# EAGLE design float002 (EAGLE 6.4)
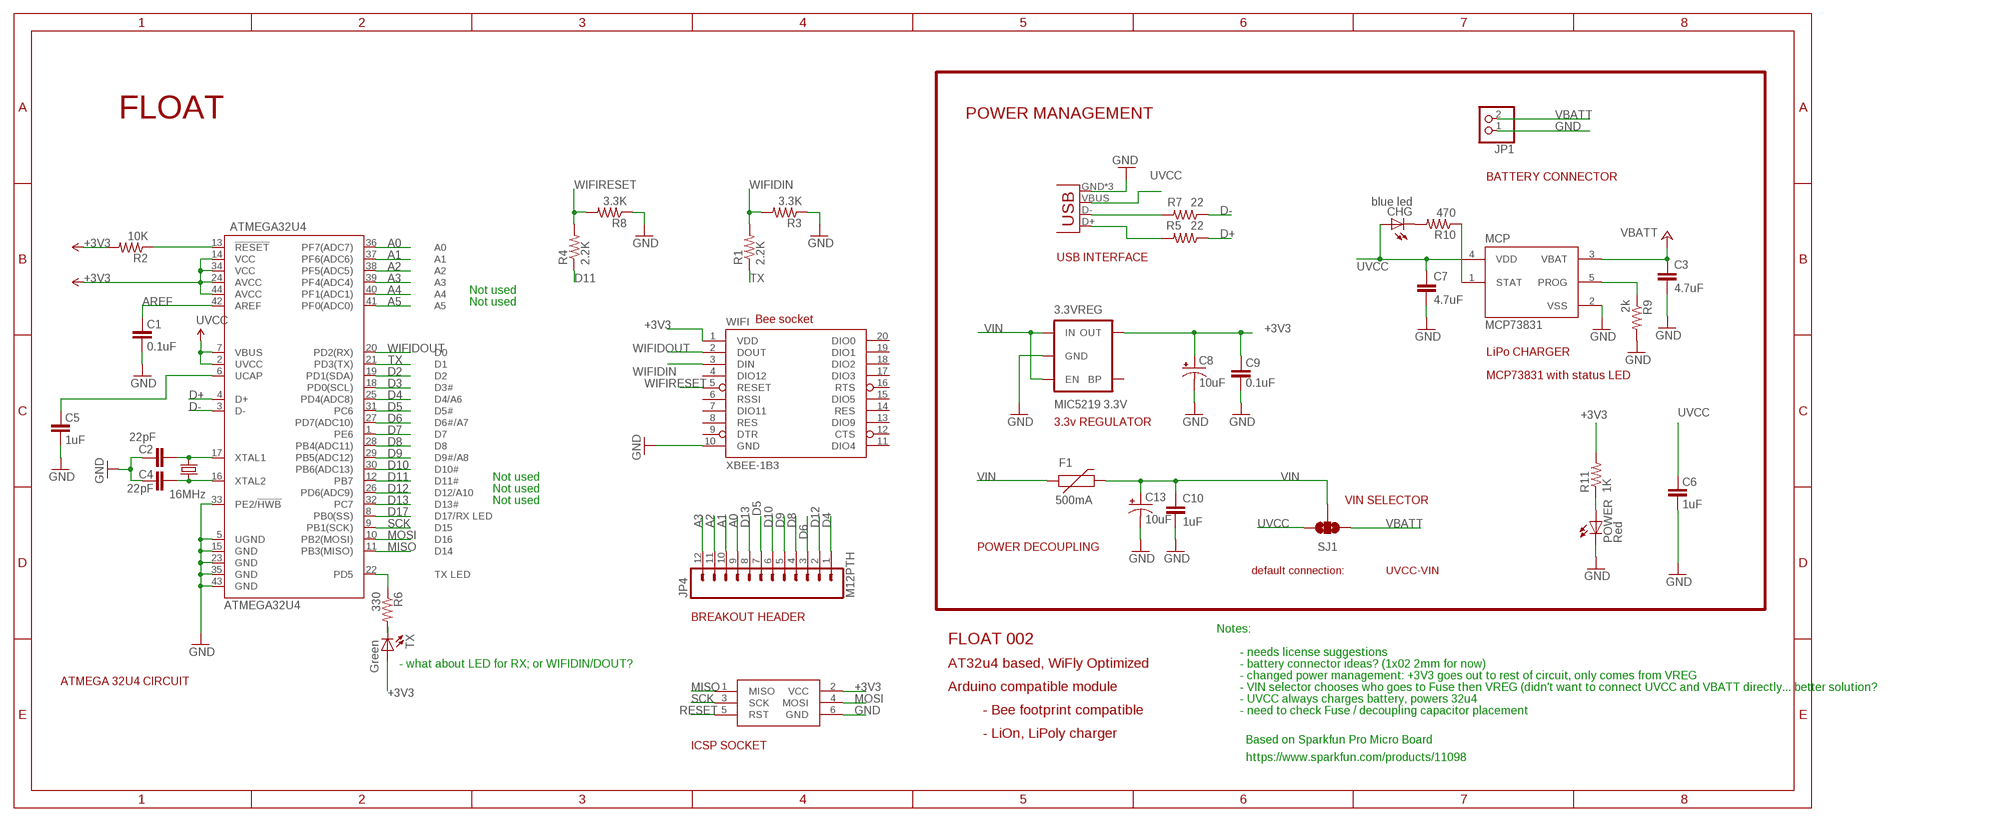
[diagram p0: schematic, sheet 1]

## Parts
3.3VREG  MIC5219 3.3V  V_REG_MIC52193.3V  [SOT23-5]
ATMEGA32U4  ATMEGA32U4  ATMEGA32U4TQFP  [SPARKFUN-DIGITALIC_TQFP44]
C1  0.1uF  CAP0402-CAP  [0402-CAP]
C2  22pF  CAP0402-CAP  [0402-CAP]
C3  4.7uF  .1UF-CER  [0402-CAP]
C4  22pF  CAP0402-CAP  [0402-CAP]
C5  1uF  CAP0402-CAP  [0402-CAP]
C6  1uF  CAP0402-CAP  [0402-CAP]
C7  4.7uF  .1UF-CER  [0402-CAP]
C8  10uF  CAP_POL1206  [EIA3216]
C9  0.1uF  CAP0402-CAP  [0402-CAP]
C10  1uF  CAP0402-CAP  [0402-CAP]
C13  10uF  CAP_POL1206  [EIA3216]
CHG  blue led  LEDCHIP-LED0805  [CHIP-LED0805]
F1  500mA  PTCSMD  [PTC-1206]
ISP1  AVRISP-6  [AVRISP]
JP1  PINHD-1X2  [1X02]
JP4  M12PTH  [1X12]
MCP  MCP73831  [SOT23-5]
POWER  Red  LED0603  [LED-0603]
R1  2.2K  RESISTOR0402-RES  [0402-RES]
R2  10K  RESISTOR0402-RES  [0402-RES]
R3  3.3K  RESISTOR0402-RES  [0402-RES]
R4  2.2K  RESISTOR0402-RES  [0402-RES]
R5  22  RESISTOR0402-RES  [0402-RES]
R6  330  RESISTOR0402-RES  [0402-RES]
R7  22  RESISTOR0402-RES  [0402-RES]
R8  3.3K  RESISTOR0402-RES  [0402-RES]
R9  2k  RESISTOR0402-RES  [0402-RES]
R10  470  RESISTOR0402-RES  [0402-RES]
R11  1K  RESISTOR0402-RES  [0402-RES]
SJ1  SOLDERJUMPER_2WAYPASTE1&2  [SJ_3_PASTE1&2]
TX  Green  LED0603  [LED-0603]
WIFI  XBEE-1B3  [XBEE-SMD]
X2  USB-MICROB  [USB-MICROB]
Y1  16MHz  CRYSTAL5X3  [CRYSTAL-SMD-5X3]

## Nets
+3V3: 3.3VREG.5(OUT) ATMEGA32U4.14(VCC) ATMEGA32U4.24(AVCC) ATMEGA32U4.34(VCC) ATMEGA32U4.44(AVCC) C8.A(+) C9.2 ISP1.2(VCC) R2.2 R11.2 TX.A WIFI.1(VDD) ; supply symbol labelled VCC
A0: ATMEGA32U4.36(PF7(ADC7)) JP4.9
A1: ATMEGA32U4.37(PF6(ADC6)) JP4.10
A2: ATMEGA32U4.38(PF5(ADC5)) JP4.11
A3: ATMEGA32U4.39(PF4(ADC4)) JP4.12
A4: ATMEGA32U4.40(PF1(ADC1))
A5: ATMEGA32U4.41(PF0(ADC0))
AREF: ATMEGA32U4.42(AREF) C1.2
D2: ATMEGA32U4.19(PD1(SDA))
D3: ATMEGA32U4.18(PD0(SCL))
D4: ATMEGA32U4.25(PD4(ADC8)) JP4.1
D5: ATMEGA32U4.31(PC6) JP4.7
D6: ATMEGA32U4.27(PD7(ADC10)) JP4.3
D7: ATMEGA32U4.1(PE6)
D8: ATMEGA32U4.28(PB4(ADC11)) JP4.4
D9: ATMEGA32U4.29(PB5(ADC12)) JP4.5
D10: ATMEGA32U4.30(PB6(ADC13)) JP4.6
D11: ATMEGA32U4.12(PB7) R4.1
D12: ATMEGA32U4.26(PD6(ADC9)) JP4.2
D13: ATMEGA32U4.32(PC7) JP4.8
D17: ATMEGA32U4.8(PB0(SS))
D+: ATMEGA32U4.4(D+) R5.1
D-: ATMEGA32U4.3(D-) R7.1
GND [vcc]: 3.3VREG.2(GND) ATMEGA32U4.5(UGND) ATMEGA32U4.15(GND) ATMEGA32U4.23(GND) ATMEGA32U4.33(PE2/!HWB) ATMEGA32U4.35(GND) ATMEGA32U4.43(GND) C1.1 C2.2 C3.2 C4.2 C5.1 C6.1 C7.2 C8.C(-) C9.1 C10.2 C13.C(-) ISP1.6(GND) JP1.1 MCP.2(VSS) POWER.C R3.1 R8.1 R9.2 WIFI.10(GND) X2.GND X2.MT1(GND) X2.MT2(GND)
MISO: ATMEGA32U4.11(PB3(MISO)) ISP1.1(MISO)
MOSI: ATMEGA32U4.10(PB2(MOSI)) ISP1.4(MOSI)
N$1: ATMEGA32U4.16(XTAL2) C4.1 Y1.1
N$2: ATMEGA32U4.17(XTAL1) C2.1 Y1.3
N$4: ATMEGA32U4.6(UCAP) C5.2
N$6: R7.2 X2.D-
N$7: R6.2 TX.C
N$8: R5.2 X2.D+
N$9: MCP.5(PROG) R9.1
N$22: MCP.1(STAT) R10.1
N$23: CHG.C R10.2
N$38: POWER.A R11.1
RESET: ATMEGA32U4.13(!RESET) ISP1.5(RST) R2.1
SCK: ATMEGA32U4.9(PB1(SCK)) ISP1.3(SCK)
TX: ATMEGA32U4.21(PD3(TX)) R1.1
TXLED: ATMEGA32U4.22(PD5) R6.1
UVCC: ATMEGA32U4.2(UVCC) ATMEGA32U4.7(VBUS) C6.2 C7.1 CHG.A MCP.4(VDD) SJ1.3 X2.VBUS
VBATT: C3.1 JP1.2 MCP.3(VBAT) SJ1.1
VIN: 3.3VREG.1(IN) 3.3VREG.3(EN) C10.1 C13.A(+) F1.1 F1.2 SJ1.2
WIFIDIN: R1.2 R3.2 WIFI.3(DIN)
WIFIDOUT: ATMEGA32U4.20(PD2(RX)) WIFI.2(DOUT)
WIFIRESET: R4.2 R8.2 WIFI.5(RESET)
Unconnected: 3.3VREG.4(BP) WIFI.4(DIO12) WIFI.6(RSSI) WIFI.7(DIO11) WIFI.8(RES) WIFI.9(DTR) WIFI.11(DIO4) WIFI.12(CTS) WIFI.13(DIO9) WIFI.14(RES) WIFI.15(DIO5) WIFI.16(RTS) WIFI.17(DIO3) WIFI.18(DIO2) WIFI.19(DIO1) WIFI.20(DIO0)

## Notes on the sheet
- FLOAT | POWER MANAGEMENT
- BATTERY CONNECTOR
- USB INTERFACE
- Not used
- Not used
- Bee socket
- LiPo CHARGER
- MCP73831 with status LED
- 3.3v REGULATOR
- Not used
- Not used
- Not used | VIN SELECTOR
- POWER DECOUPLING
- default connection: | UVCC-VIN
- BREAKOUT HEADER
- Notes:
- FLOAT 002
- - needs license suggestions
- - what about LED for RX; or WIFIDIN/DOUT? | AT32u4 based, WiFly Optimized | - battery connector ideas? (1x02 2mm for now)
- - changed power management: +3V3 goes out to rest of circuit, only comes from VREG
- ATMEGA 32U4 CIRCUIT
- Arduino compatible module | - VIN selector chooses who goes to Fuse then VREG (didn't want to connect UVCC and VBATT directly... better solution?
- - UVCC always charges battery, powers 32u4
- - Bee footprint compatible | - need to check Fuse / decoupling capacitor placement
- - LiOn, LiPoly charger
- Based on Sparkfun Pro Micro Board
- ICSP SOCKET
- https://www.sparkfun.com/products/11098

## Library data of the parts
3.3VREG = SparkFun-PowerIC:V_REG_MIC5219: V_REG MIC5219 Standard 500mA LDO voltage regulator in SOT-23 layout. Micrel part MIC5219. BP (by-pass) pin is used to lower output noise with 470pF cap, may be left open.; PROD_ID: VREG-09872
ATMEGA32U4 = SparkFun-DigitalIC:ATMEGA32U4: Atmel 44-pin 8-bit Microcontroller with 32KBytes of ISP Flash and USB Controller
C1 C2 C4-C6 C9 C10 = SparkFun:CAP: Capacitor Standard 0603 ceramic capacitor, and 0.1" leaded capacitor.
C3 C7 = SparkFun-Capacitors:.1UF-CER: .1uF ceramic SMT CAP-00810- 25V +80%/-20% (0603) CAP-08390- 100V 10% (0603) CAP-08604- 25V 5% (0603); PROD_ID: CAP-00810; VALUE: 0.1uF
C8 C13 = SparkFun:CAP_POL: Capacitor Polarized These are standard SMD and PTH capacitors. Normally 10uF, 47uF, and 100uF in electrolytic and tantalum varieties. Always verify the external diameter of the through hole cap, it varies with capacity, voltage, and manufacturer. The EIA devices should be standard.
CHG = adafruit:LED: LED OSRAM: - CHIPLED LG R971, LG N971, LY N971, LG Q971, LY Q971, LO R971, LY R971 LH N974, LH R974 LS Q976, LO Q976, LY Q976 LO Q996 - Hyper CHIPLED LW Q18S LB Q993, LB Q99A, LB R99A - SideLED LS A670, LO A670, LY A670, LG A670, LP A670 LB A673, LV A673, LT A673, LW A673 LH A674 LY A675 LS A676, LA A676, LO A676, LY A676, LW A676 LS A679, LY A679, LG A679 - Hyper Micro SIDELED® LS Y876, LA Y876, LO Y876, LY Y876 LT Y87S - SmartLED LW L88C, LW L88S LB L89C, LB L89S, LG L890 LS L89K, LO L89K, LY L89K LS L896, LA L896, LO L896, LY L896 - TOPLED LS T670, LO T670, LY T670, LG T670, LP T670 LSG T670, LSP T670, LSY T670, LOP T670, LYG T670 LG T671, LOG T671, LSG T671 LB T673, LV T673, LT T673, LW T673 LH T674 LS T676, LA T676, LO T676, LY T676, LB T676, LH T676, LSB T676, LW T676 LB T67C, LV T67C, LT T67C, LS T67K, LO T67K, LY T67K, LW E67C LS E67B, LA E67B, LO E67B, LY E67B, LB E67C, LV E67C, LT E67C LW T67C LS T679, LY T679, LG T679 LS T770, LO T770, LY T770, LG T770, LP T770 LB T773, LV T773, LT T773, LW T773 LH T774 LS E675, LA E675, LY E675, LS T675 LS T776, LA T776, LO T776, LY T776, LB T776 LHGB T686 LT T68C, LB T68C - Hyper Mini TOPLED® LB M676 - Mini TOPLED Santana® LG M470 LS M47K, LO M47K, LY M47K Source: http://www.osram.convergy.de/
F1 = SparkFun:PTC: Resettable Fuse PTC Resettable Fuse. Spark Fun Electronics SKU : COM-08357
ISP1 = adafruit:AVRISP: AVR ISP HEADER Standard 6 pin header for AVR programming
JP1 = pinhead:PINHD-1X2: PIN HEADER
JP4 = SparkFun-Connectors:M12: Header 12 Standard 12-pin 0.1" header. Use with straight break away headers (SKU : PRT-00116), right angle break away headers (PRT-00553), swiss pins (PRT-00743), machine pins (PRT-00117), and female headers (PRT-00115).
MCP = ze_ic:MCP73831: Microchip 73831 Li-Poly charger IC
POWER TX = SparkFun:LED: LEDs Standard schematic elements and footprints for 5mm, 3mm, 1206, and 0603 sized LEDs. 5mm - Spark Fun Electronics SKU : COM-00529 (and others)
R1-R8 R11 = SparkFun:RESISTOR: Resistor Basic schematic elements and footprints for 0603, 1206, and PTH resistors.
R9 R10 = SparkFun-Resistors:RESISTOR: Resistor Basic schematic elements and footprints for 0603, 1206, and PTH resistors.
SJ1 = SparkFun-Passives:SOLDERJUMPER_2WAY: Solder Jumper 2 way solder jumper
WIFI = SparkFun-RF:XBEE-1: Xbee module footprints SMT header is CONN-09042.; PROD_ID: CONN-09042
X2 = SparkFun-Connectors:USB: USB Connectors USB-B-PTH is fully proven SKU : PRT-00139/CONN-08278 USB-miniB is fully proven SKU : PRT-00587 USB-A-PCB is untested. USB-A-H is throughly reviewed, but untested. Spark Fun Electronics SKU : PRT-00437 USB-B-SMT is throughly reviewed, but untested. Needs silkscreen touching up. USB-A-S has not been used/tested USB-MB-H has not been used/tested USB-MICROB has been used. CONN-09505; PROD_ID: CONN-09505
Y1 = SparkFun:CRYSTAL: Crystals Various standard crystals. Proven footprints. Spark Fun Electronics SKU : COM-00534

## Net classes
0 default: width 0.003 mm, drill 0.254 mm, clearance 0.152 mm

## Board
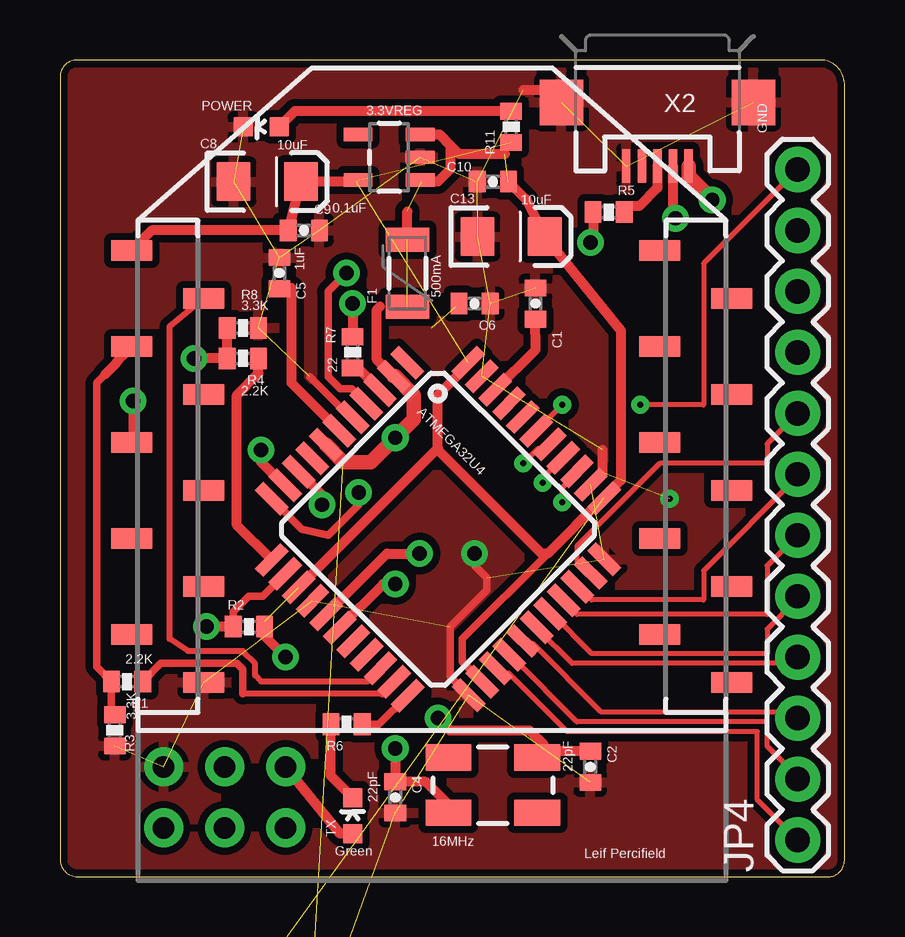
[diagram p1: board, top side]
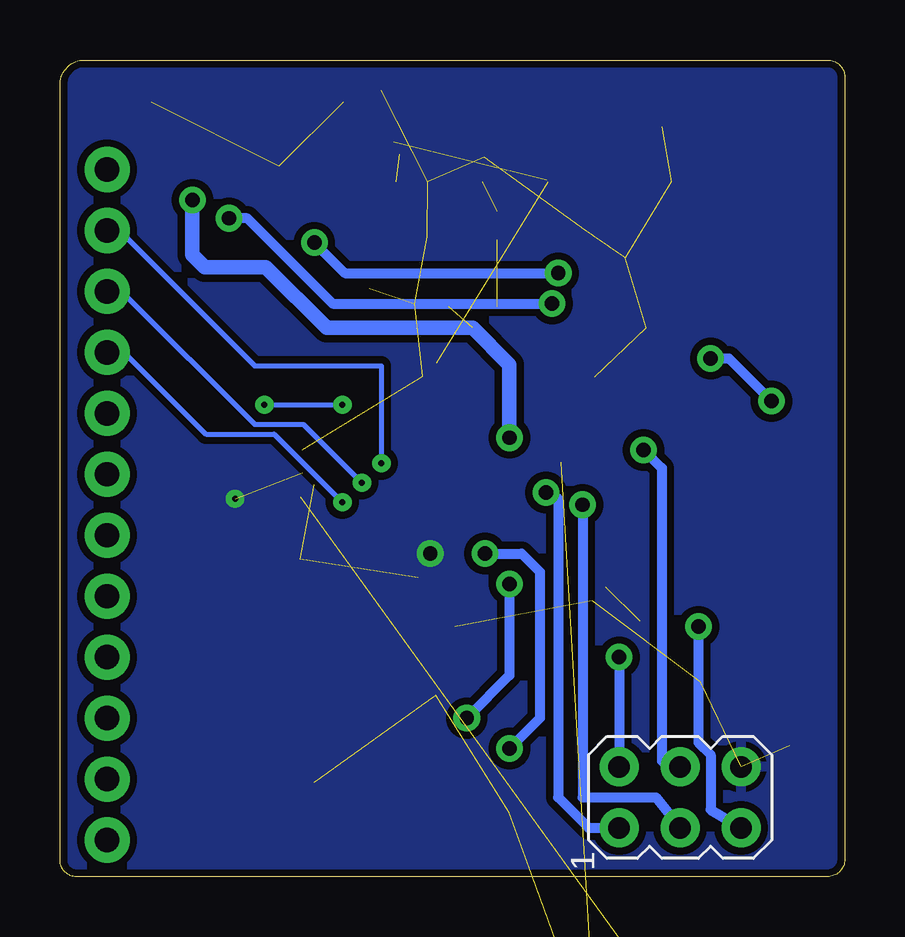
[diagram p2: board, bottom side, seen from below]

Size 32.7 x 34.03 mm. Coordinates in mm from the lower left corner, seen from the top.
Outline: 0,0.72 arc90 0.72,0 32.02,0 arc90 32.69,0.67 32.69,32.86 arc90 31.78,34.03 0.71,34.03 arc90 0,33.32 0,0.72
Copper layers (1*16): Top 0.035mm / dielectric 1.5mm / Bottom 0.035mm
Design rules "default": minimum track width 8mil, minimum drill 10mil, track to track 8mil, track to pad 8mil, pad to pad 8mil, via to via 8mil, smd to smd 8mil, copper to edge 10mil, drill to drill 8mil, minimum pad ring 12mil, minimum via ring 10mil, stop-mask expansion 4mil, vias tented up to drill 25mil, thermal gap 10mil

### Footprints (pad centres in the part's own frame; a part is rotated, then mirrored left to right if it is on the bottom)
SOT23-5 = smd 0.55 x 1.2: 1 -0.95,-1.3; 2 0,-1.3; 3 0.95,-1.3; 4 0.95,1.3; 5 -0.95,1.3
SPARKFUN-DIGITALIC_TQFP44 = smd 1.5 x 0.5: 1 -5.8,4; 2 -5.8,3.2; 3 -5.8,2.4; 4 -5.8,1.6; 5 -5.8,0.8; 6 -5.8,0; 7 -5.8,-0.8; 8 -5.8,-1.6; 9 -5.8,-2.4; 10 -5.8,-3.2; 11 -5.8,-4; 23 5.8,-4; 24 5.8,-3.2; 25 5.8,-2.4; 26 5.8,-1.6; 27 5.8,-0.8; 28 5.8,0; 29 5.8,0.8; 30 5.8,1.6; 31 5.8,2.4; 32 5.8,3.2; 33 5.8,4 | smd 0.5 x 1.5: 12 -4,-5.8; 13 -3.2,-5.8; 14 -2.4,-5.8; 15 -1.6,-5.8; 16 -0.8,-5.8; 17 0,-5.8; 18 0.8,-5.8; 19 1.6,-5.8; 20 2.4,-5.8; 21 3.2,-5.8; 22 4,-5.8; 34 4,5.8; 35 3.2,5.8; 36 2.4,5.8; 37 1.6,5.8; 38 0.8,5.8; 39 0,5.8; 40 -0.8,5.8; 41 -1.6,5.8; 42 -2.4,5.8; 43 -3.2,5.8; 44 -4,5.8
0402-CAP = smd 0.7 x 0.9: 1 -0.65,0; 2 0.65,0
EIA3216 = smd 1.4 x 1.6: A 1.4,0; C -1.4,0
CHIP-LED0805 = smd 1.2 x 1.2: A 0,-1.05; C 0,1.05
PTC-1206 = smd 1 x 1.8: 1 -1.4,0; 2 1.4,0
AVRISP = drill 0.9 pad 1.626: 1 -1.27,2.54; 2 1.27,2.54; 3 -1.27,0; 4 1.27,0; 5 -1.27,-2.54; 6 1.27,-2.54
1X02 = drill 1.016 long: 1 -1.27,0; 2 1.27,0
1X12 = drill 1.016 pad 1.88: 1 0,0; 2 2.54,0; 3 5.08,0; 4 7.62,0; 5 10.16,0; 6 12.7,0; 7 15.24,0; 8 17.78,0; 9 20.32,0; 10 22.86,0; 11 25.4,0; 12 27.94,0
SOT23-5' = smd 0.6 x 1.2: 1 -0.95,-1.306; 2 0,-1.306; 3 0.95,-1.306; 4 0.95,1.306; 5 -0.95,1.306
LED-0603 = smd 0.8 x 0.8: A 0,-0.75; C 0,0.75
0402-RES = smd 0.7 x 0.9: 1 -0.65,0; 2 0.65,0
SJ_3_PASTE1&2 = smd 0.635 x 1.27: 1 -0.813,0; 2 0,0; 3 0.813,0
XBEE-SMD = smd 1.7 x 0.85: 1 -12.5,20; 2 -9.5,18; 3 -12.5,16; 4 -9.5,14; 5 -12.5,12; 6 -9.5,10; 7 -12.5,8; 8 -9.5,6; 9 -12.5,4; 10 -9.5,2; 11 12.5,2; 12 9.5,4; 13 12.5,6; 14 9.5,8; 15 12.5,10; 16 9.5,12; 17 12.5,14; 18 9.5,16; 19 12.5,18; 20 9.5,20
USB-MICROB = smd 0.35 x 1.4: D+ 0,2.65; D- -0.65,2.65; GND 1.3,2.65; ID 0.65,2.65; VBUS -1.3,2.65 | smd 1.8 x 1.9: MT1 -4,0; MT2 4,0
CRYSTAL-SMD-5X3 = smd 1.9 x 1.1: 1 -1.85,-1.15; 2 1.85,-1.15; 3 1.85,1.15; 4 -1.85,1.15

### Placement (x,y rotation side)
3.3VREG  13.72,29.97 90 top
ATMEGA32U4  15.75,14.48 315.1 top
C1  19.81,23.88 270 top
C2  22.1,4.57 270 top
C3  1.52,-13.97 0 top  (outside the outline)
C4  13.97,3.3 270 top
C5  9.14,25.15 270 top
C6  17.27,23.88 180 top
C7  8.13,-13.46 0 top  (outside the outline)
C8  8.64,28.96 0 top
C9  10.16,26.92 180 top
C10  18.03,28.96 180 top
C13  18.8,26.67 0 top
CHG  2.79,-8.38 0 top  (outside the outline)
F1  14.48,25.15 90 top
ISP1  6.86,3.3 90 bottom
JP1  3.05,-23.11 0 top  (outside the outline)
JP4  30.73,1.52 90 top
MCP  MCP73831  [SOT23-5']  9.4,-8.64 0 top  (outside the outline)
POWER  8.38,31.24 90 top
R1  2.79,8.13 180 top
R2  7.87,10.41 0 top
R3  2.29,6.1 90 top
R4  7.62,21.59 180 top
R5  22.86,27.69 0 top
R6  11.94,6.35 180 top
R7  12.19,21.84 90 top
R8  7.62,22.86 180 top
R9  1.52,-17.78 0 top  (outside the outline)
R10  4.57,-17.78 0 top  (outside the outline)
R11  18.8,31.24 270 top
SJ1  -5.08,-22.61 0 top  (outside the outline)
TX  12.19,2.54 0 top
WIFI  15.49,6.1 0 top
X2  24.89,32.26 180 top
Y1  18.03,3.81 0 top

### Tracks (layer width: path | path; a pad name or v marks a point on that pad's centre or on a via)
+3V3  (via drill 0.6)  (3 unrouted)
  Top 0.305: ATMEGA32U4.24 16.76,8.95 16.76,9.91 20.32,13.46
  Top 0.406: 3.3VREG.5 12.35,28.96 C8.A 10.02,28.94 C9.2 3.82,26.92 WIFI.1 | 8.52,10.63 R2.2 8.52,10.02 v9.4,9.14 | TX.A 11.67,1.79 ISP1.2 | ATMEGA32U4.14 15.71,17.82 | 15.71,17.82 15.75,17.86 15.75,20.07 17.01,21.33 ATMEGA32U4.44 | ATMEGA32U4.34 22.62,15.76 20.32,13.46 20.07,13.46 15.75,17.78 | 15.75,17.78 | 15.75,17.78 15.71,17.82
  Bottom 0.406: v9.4,9.14 ISP1.2
A0  (via drill 0.25)
  Top 0.203: v20.93,15.6 20.93,16.2 21.54,16.82 ATMEGA32U4.36
  Bottom 0.203: v20.93,15.6 23.77,18.44 26.62,18.44 29.87,21.69 30.68,21.69 JP4.9
A1  (via drill 0.25)
  Top 0.203: v20.12,16.41 20.12,16.61 20.93,17.42 ATMEGA32U4.37
  Bottom 0.203: v20.12,16.41 22.55,18.85 24.59,18.85 30.07,24.33 30.68,24.33 JP4.10
A2  (via drill 0.25)
  Top 0.203: v19.3,17.22 19.91,17.83 20.32,17.83 ATMEGA32U4.38
  Bottom 0.203: v19.3,17.22 19.3,21.29 24.59,21.29 30.28,26.98 30.68,26.98 JP4.11
A3  (via drill 0.25)
  Top 0.203: v20.93,19.66 19.91,18.64 ATMEGA32U4.39 | v24.18,19.66 26.82,19.66 26.82,25.55 JP4.12
  Bottom 0.203: v24.18,19.66 v20.93,19.66
AREF
  Top 0.406: ATMEGA32U4.42 19.82,21.96 C1.2
D2
  Top 0.406: ATMEGA32U4.19
D4
  Top 0.203: JP4.1 29.06,3.2 29.06,6.05 21.13,6.05 18.69,8.48 18.29,8.48 ATMEGA32U4.25
D5
  Top 0.203: ATMEGA32U4.31 21.74,11.94 22.15,11.53 26.82,11.53 26.82,12.75 30.68,16.61 JP4.7
D6
  Top 0.203: ATMEGA32U4.27 19.3,9.7 19.71,9.7 22.55,6.86 30.68,6.86 30.68,6.66 JP4.3
D8
  Top 0.203: ATMEGA32U4.28 19.91,10.31 21.34,8.89 30.68,8.89 30.68,9.09 JP4.4
D9
  Top 0.203: ATMEGA32U4.29 20.52,10.92 22.15,9.3 29.46,9.3 29.46,10.31 30.68,11.53 JP4.5
D10
  Top 0.203: JP4.6 29.46,12.95 29.46,10.92 21.54,10.92 21.13,11.33 ATMEGA32U4.30
D11
  Top 0.406: ATMEGA32U4.12 7.37,14.65 7.37,20.07 8.27,20.97 R4.1
D12
  Top 0.203: ATMEGA32U4.26 18.9,9.09 21.54,6.45 29.46,6.45 29.46,5.44 30.68,4.22 JP4.2
D13
  Top 0.203: JP4.8 29.46,18.03 29.46,17.22 24.99,17.22 21.54,13.77 21.54,13.16 21.95,12.75 ATMEGA32U4.32
D+  (via drill 0.6)
  Top 0.305: v11.94,25.15 11.18,24.38 11.18,20.83 11.68,20.32 12.15,20.32 ATMEGA32U4.4
  Top 0.406: R5.1 22.21,26.53 v22.1,26.42
  Bottom 0.406: v22.1,26.42 20.83,25.15 v11.94,25.15
D-
  Top 0.406: R7.1 12.41,21.19 ATMEGA32U4.3
GND  (via drill 0.25 pad 0.25, 0.6)  (29 unrouted)
  Top 0.305: ATMEGA32U4.23 16.26,8.33 16.26,10.41 17.78,11.94 17.78,12.45 17.27,12.95 v17.27,13.46 | ATMEGA32U4.5 12.1,19.14 10.41,20.83
  Top 0.406: X2.MT2 20.38,32.77 19.3,32.77 | ATMEGA32U4.35 22.61,16.83 22.61,17.78
  other vias: 25.4,15.75
  pour Top (isolate 0.305): 0,34.04 32.77,34.04 32.77,-0.25 0,0
  pour Bottom (isolate 0.305): 0,34.04 32.77,34.04 32.77,-0.25 0,0
MISO  (via drill 0.6)
  Top 0.305: ATMEGA32U4.11 10.08,14.48 11.18,14.22 12.45,15.49 v12.45,16
  Bottom 0.406: v12.45,16 11.94,15.75 11.94,3.3 10.67,2.03 ISP1.1
MOSI  (via drill 0.6)
  Top 0.406: ATMEGA32U4.10 9.35,16.3 8.38,17.27 v8.38,17.78
  Bottom 0.406: v8.38,17.78 7.62,17.02 7.62,4.83 ISP1.4
N$1  (via drill 0.6)
  Top 0.406: Y1.1 16.18,3.01 15.24,3.95 C4.1 v13.97,5.33 | ATMEGA32U4.16 13.62,13.46 v14.99,13.46
  Bottom 0.406: v14.99,13.46 13.46,13.46 12.7,12.7 12.7,6.6 v13.97,5.33
N$2  (via drill 0.6)
  Top 0.406: C2.1 20.15,5.22 | 20.15,5.22 Y1.3 | ATMEGA32U4.17 13.46,12.19 v13.97,12.19 | v15.75,6.6 16.26,6.1 19.56,6.1 20.15,5.51 20.15,5.22
  Bottom 0.406: v13.97,12.19 13.97,8.38 v15.75,6.6
N$4
  Top 0.406: ATMEGA32U4.6 9.65,20.56 9.65,24.5 C5.2 9.65,24.53
N$6  (via drill 0.6)
  Top 0.406: v12.19,23.88 R7.2 | v25.65,27.43 25.54,27.54 X2.D-
  Bottom 0.406: v12.19,23.88 21.34,23.88 24.89,27.43 v25.65,27.43
N$7
  Top 0.406: TX.C 11.29,4.19 R6.2
N$8
  Top 0.406: X2.D+ 24.89,28.7 24.13,27.94 23.76,27.94 R5.2
N$9  (1 unrouted)
N$22  (1 unrouted)
N$23  (1 unrouted)
N$38
  Top 0.406: R11.1 9.78,31.89 POWER.A
RESET  (via drill 0.6)
  Top 0.305: 7.22,10.47 7.22,11.03 7.87,11.68 8.44,11.68 ATMEGA32U4.13
  Top 0.406: 7.22,10.47 R2.1 v6.1,10.41
  Bottom 0.406: v6.1,10.41 6.1,5.59 5.59,5.08 5.59,2.79 ISP1.5
SCK  (via drill 0.6)
  Top 0.406: ATMEGA32U4.9 10.92,15.9 v10.92,15.49
  Bottom 0.406: v10.92,15.49 10.92,3.3 7.87,3.3 ISP1.3
TX
  Top 0.254: 13.43,7.62 7.62,7.62
  Top 0.305: ATMEGA32U4.21 13.43,7.62 | 7.62,7.62 7.62,8.64 7.37,8.89 4.21,8.89 R1.1
TXLED
  Top 0.305: R6.1 13.29,6.35 ATMEGA32U4.22
UVCC  (via drill 0.6)  (5 unrouted)
  Top 0.406: ATMEGA32U4.2 13.21,21.53 13.21,23.62 13.33,23.75 | 16.49,23.75 C6.2
  Top 0.61: ATMEGA32U4.7 11.81,17.27 12.95,17.27 v13.97,18.29 14.73,19.05 14.73,20.07 13.96,20.84 ATMEGA32U4.2 | v27.18,28.19 26.19,29.18 X2.VBUS
  Bottom 0.61: v13.97,18.29 13.97,21.34 15.49,22.86 21.59,22.86 24.13,25.4 26.67,25.4 27.18,25.91 v27.18,28.19
VBATT  (3 unrouted)
VIN  (4 unrouted)
  Top 0.406: 3.3VREG.3 15.81,30.92 16.26,30.48 | 16.26,30.48 16.26,29.46 15.75,28.96 15.08,28.96 3.3VREG.1 | 18.53,30.11 16.63,30.11 16.26,30.48 | 22.67,15.82 23.37,16.51 23.37,22.74 C13.A 19.43,28.21 C10.1 | F1.2 14.48,27.72
WIFIDIN
  Top 0.305: R3.2 2.14,6.89 R1.2 1.52,8.75 1.52,20.57 2.64,21.69 2.64,21.74
  Top 0.406: WIFI.3 2.64,21.74 2.49,21.59 2.29,21.34 1.89,20.94
WIFIDOUT
  Top 0.254: ATMEGA32U4.20 12.81,8.13 8.38,8.13 8.13,8.38 8.13,8.89 7.62,9.4 5.33,9.4 4.57,9.91 4.57,22.93 WIFI.2
WIFIRESET  (via drill 0.6)
  Top 0.406: R8.2 R4.2 v5.59,21.59 | v3.05,19.81 3.05,18.15 WIFI.5
  Bottom 0.406: v5.59,21.59 4.83,21.59 v3.05,19.81

### Text on the board
tPlace: GND | Leif Percifield